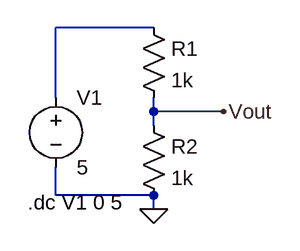
[diagram p0: schematic PotentialDivider.asc]
PotentialDivider.asc, the LTspice schematic file:
Version 4
SHEET 1 880 680
WIRE 176 64 64 64
WIRE 64 144 64 64
WIRE 176 160 176 144
WIRE 256 160 176 160
WIRE 176 176 176 160
WIRE 64 256 64 224
WIRE 176 256 64 256
WIRE 176 272 176 256
FLAG 176 272 0
FLAG 256 160 Vout
SYMBOL voltage 64 128 R0
WINDOW 123 0 0 Left 2
WINDOW 39 0 0 Left 2
SYMATTR InstName V1
SYMATTR Value 5
SYMBOL res 160 48 R0
SYMATTR InstName R1
SYMATTR Value 1k
SYMBOL res 160 160 R0
SYMATTR InstName R2
SYMATTR Value 1k
TEXT 32 264 Left 2 !.dc V1 0 5

The netlist it stands for:
* PotentialDivider.asc
V1 N001 0 5
R1 N001 Vout 1k
R2 Vout 0 1k
.dc V1 0 5
.backanno
.end